# Altium schematic sheet Sheet7.SchDoc
size A4; Organization: Altium Limited; Address1: L3, 12a Rodborough Rd; Address2: Frenchs Forest; Address3: NSW; Address4: Australia 2086
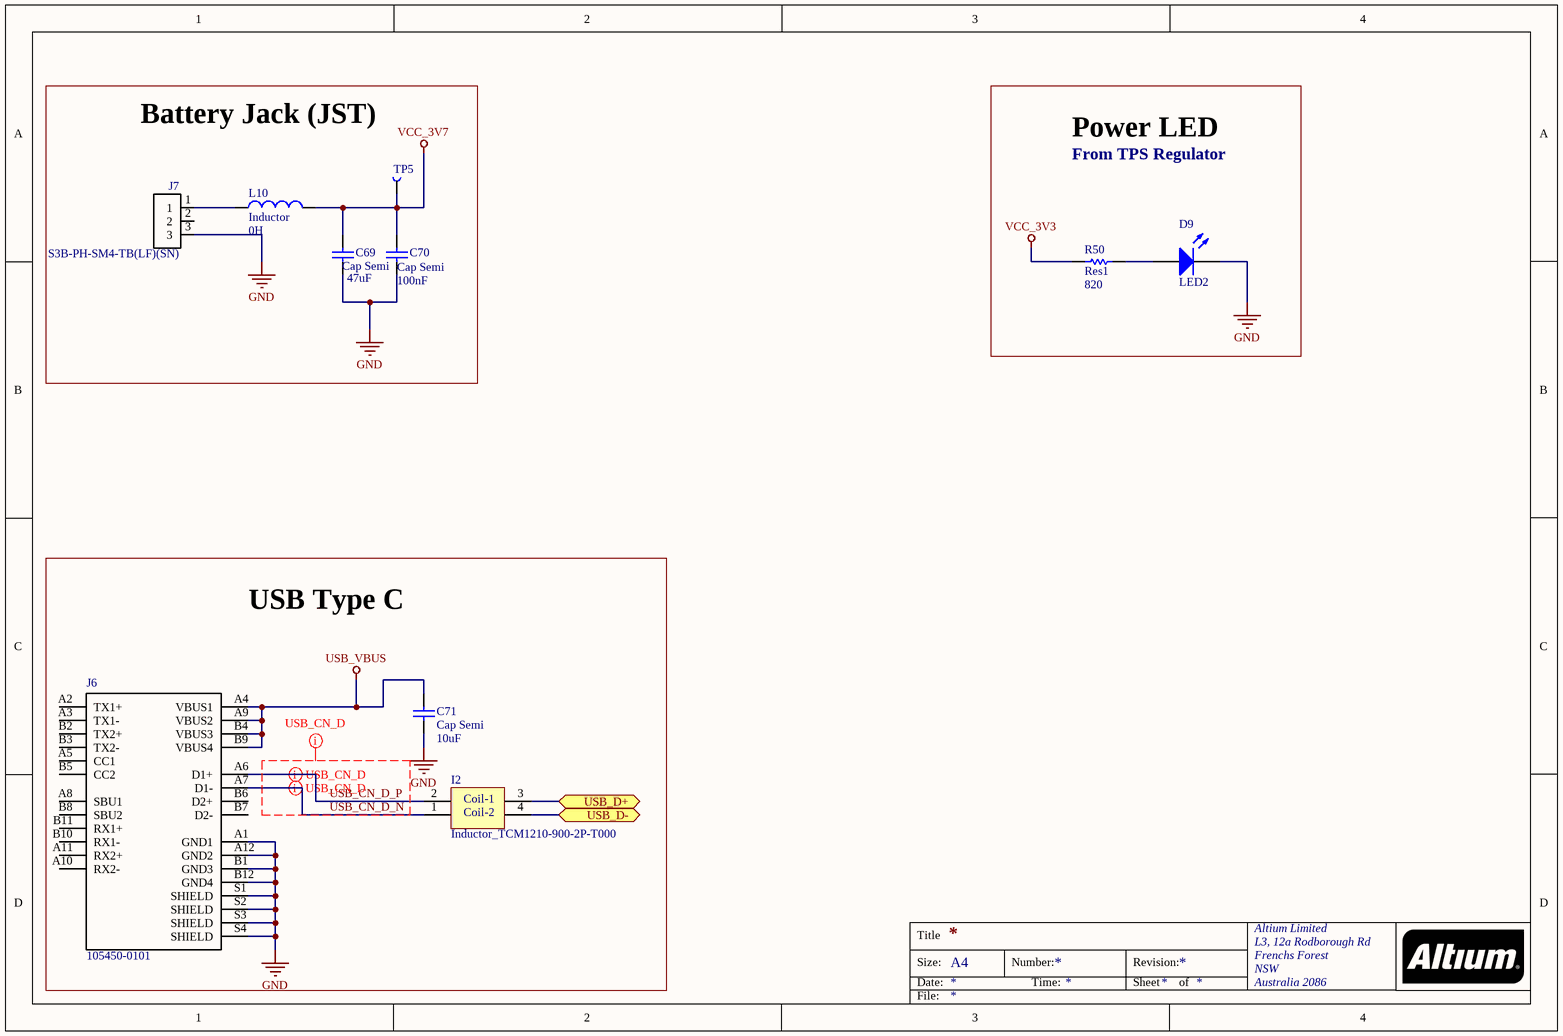
[diagram p0: Sheet7.SchDoc]

## Parts
C69  Cap Semi  value 47uF  [CAP 1206/3216]
C70  Cap Semi  value 100nF  [CAP 0402/1005]
C71  Cap Semi  value 10uF  [CAP 0603/1608]
D9  LED2  [LED_0603 - 3D]
I2  Inductor_TCM1210-900-2P-T000  [Inductor_TCM1210-900-2P-T000]
J6  105450-0101  [*MOLEX_105450-0101]
J7  S3B-PH-SM4-TB(LF)(SN)  [*JST_S3B-PH-SM4-TB(LF)(SN)]
L10  Inductor  value 0H  [INDC1608L]
R50  Res1  value 820  [RES 0402/1005]
TP5  TestPoint  [TestPoint]  (value not drawn)

## Blocks framed on the sheet
Battery Jack (JST): C69 C70 J7 L10 TP5
Power LED: D9 R50
USB Type C: C71 I2 J6

## Ports
USB_D+ (bidir), USB_D- (bidir)

## Nets
GND: C69.1 C70.1 C71.1 D9.2(K) J6.A1(GND1) J6.A12(GND2) J6.B1(GND3) J6.B12(GND4) J6.S1(SHIELD) J6.S2(SHIELD) J6.S3(SHIELD) J6.S4(SHIELD) J7.3
USB_VBUS: C71.2 J6.A4(VBUS1) J6.A9(VBUS2) J6.B4(VBUS3) J6.B9(VBUS4)
VCC_3V3: R50.2
VCC_3V7: C69.2 C70.2 L10.2 TP5.1(TP)
USB_CN_D_N: I2.1 J6.A7(D1-)
USB_CN_D_P: I2.2 J6.A6(D1+)
USB_D+: I2.3 ; port USB_D+
USB_D-: I2.4 ; port USB_D-
NetD9_1: D9.1(A) R50.1
NetJ7_1: J7.1 L10.1

Not connected (* = marked no-connect by the designer): J6 A2(TX1+) A3(TX1-) A5(CC1) A8(SBU1) A10(RX2-) A11(RX2+) B2(TX2+) B3(TX2-) B5(CC2) B6(D2+) B7(D2-) B8(SBU2) B10(RX1-) B11(RX1+); J7 2

## Layout directives
differential pair; net class USB_1; net class *: USB_CN_D_P
differential pair; net class USB_1: USB_CN_D_N
mark named USB_CN_D: USB_CN_D_N, USB_CN_D_P

## Notes on the sheet
- From TPS Regulator
- Title
- Size:
- Date:
- A4
- Number:
- Time:
- Revision:
- Sheet
- of
- File:
- (in symbol Inductor_TCM1210-900-2P-T000) Coil-1; Coil-2

## Library data of the parts
C69 = Cap Semi: 47µF ±20% 10V Ceramic Capacitor X5R 1206 (3216 Metric); Part Number: LMK316BJ476ML-T; LatestRevisionDate: 29-May-2009; LatestRevisionNote: IPC-7351 Footprint Added.; PackageReference: C1206; Publisher: Altium Limited; PackageDescription: Chip Capacitor; Supplier Link: https://www.digikey.com/product-detail/en/taiyo-yuden/LMK316BJ476ML-T/587-1780-1-ND/1212796
C70 = Cap Semi: 0.1µF -20%, +80% 16V Ceramic Capacitor Y5V (F) 0402 (1005 Metric); Part Number: VJ0402V104ZXJCW1BC; Published: 8-Jun-2000; LatestRevisionDate: 29-May-2009; LatestRevisionNote: IPC-7351 Footprint Added.; PackageReference: C1206; PackageDescription: Chip Capacitor; Supplier Link: https://www.digikey.com/product-detail/en/vishay-vitramon/VJ0402V104ZXJCW1BC/720-1523-1-ND/420979
C71 = Cap Semi: 10µF ±20% 10V Ceramic Capacitor X5R 0603 (1608 Metric); Part Number: GRM188R61A106ME69D; LatestRevisionDate: 29-May-2009; LatestRevisionNote: IPC-7351 Footprint Added.; PackageReference: C1206; Publisher: Altium Limited; PackageDescription: Chip Capacitor; Supplier Link: https://www.digikey.com/product-detail/en/murata-electronics-north-america/GRM188R61A106ME69D/490-10475-1-ND/5026393
D9 = LED2: Green 570nm LED Indication - Discrete 1.7V 0603 (1608 Metric); Part Number: LG L29K-F2J1-24-Z; Published: 8-Jun-2000; LatestRevisionDate: 17-Jul-2002; LatestRevisionNote: Re-released for DXP Platform.; PackageVersion: Feb-2002; PackageReference: 3.2X1.6X1.1; Publisher: Altium Limited; PackageDescription: SM LED; 2 Flat Leads; Supplier Link: https://www.digikey.com/product-detail/en/osram-opto-semiconductors-inc/LG-L29K-F2J1-24-Z/475-3118-1-ND/4899549
I2 = Inductor_TCM1210-900-2P-T000: Common Mode Chokes / Filters; Part Number: TCM1210-900-2P-T000; Supplier Link: https://eu.mouser.com/ProductDetail/TDK/TCM1210-900-2P-T000?qs=%2Fha2pyFaduia2Sf2XsGzKKKR0SZzgM3gI6%2FyoQ%2FKuJLC9pPLP%252BCPyQawxd0Jpcuo
J6 = 105450-0101: USB - C USB 3.1 (USB 3.1 Gen 2, Superspeed+) Receptacle Connector 24 Position Surface Mount, Right Angle; Through Hole; Part Number: 1054500101; MF: Molex; SnapEDA_Link: https://www.snapeda.com/parts/1054500101/Molex/view-part/?ref=snap; Price: None; Availability: Unavailable; Package: None; Value: *; Supplier Link: https://www.digikey.com/product-detail/en/molex/1054500101/WM12856CT-ND/5843891
J7 = S3B-PH-SM4-TB(LF)(SN): Connector Header Surface Mount, Right Angle 3 position 0.079" (2.00mm); MF: JST Sales; SnapEDA_Link: https://www.snapeda.com/parts/S3B-PH-SM4-TB%28LF%29%28SN%29/JST%20Sales%20America%20Inc./view-part/?ref=snap; Price: None; Part Number: S3B-PH-SM4-TB(LF)(SN); Package: None; Availability: Unavailable; Value: *; Supplier Link: https://www.digikey.com/product-detail/en/jst-sales-america-inc/S3B-PH-SM4-TB-LF-SN/455-1750-1-ND/926847
L10 = Inductor: 220 Ohms @ 100MHz 1 Power Line Ferrite Bead 0603 (1608 Metric) 2.2A 50 mOhm; Part Number: MPZ1608S221ATA00; Code_IEC: 1005; Published: 8-Jun-2000; LatestRevisionDate: 29-May-2009; LatestRevisionNote: IPC-7351 Footprint Added.; PackageReference: 0402-A; Publisher: Altium Limited; PackageDescription: Chip Inductor; Code_JEITA: 0402; Supplier Link: https://www.digikey.com/product-detail/en/tdk-corporation/MPZ1608S221ATA00/445-1565-1-ND/571895
R50 = Res1: 820 Ohms ±5% 0.1W, 1/10W Chip Resistor 0402 (1005 Metric) Automotive AEC-Q200 Thick Film; Part Number: RK73B1ETTP821J; Published: 8-Jun-2000; LatestRevisionDate: 17-Jul-2002; LatestRevisionNote: Re-released for DXP Platform.; PackageReference: AXIAL-0.3; PackageDescription: Axial Device, Thru-Hole; 2 Leads; 0.3 in Pin Spacing; Supplier Link: https://www.digikey.com/product-detail/en/koa-speer-electronics-inc/RK73B1ETTP821J/2019-RK73B1ETTP821JCT-ND/9846073